# EAGLE schematic teensy-boom (EAGLE 7.3.0)

## Sheet 1 of 5
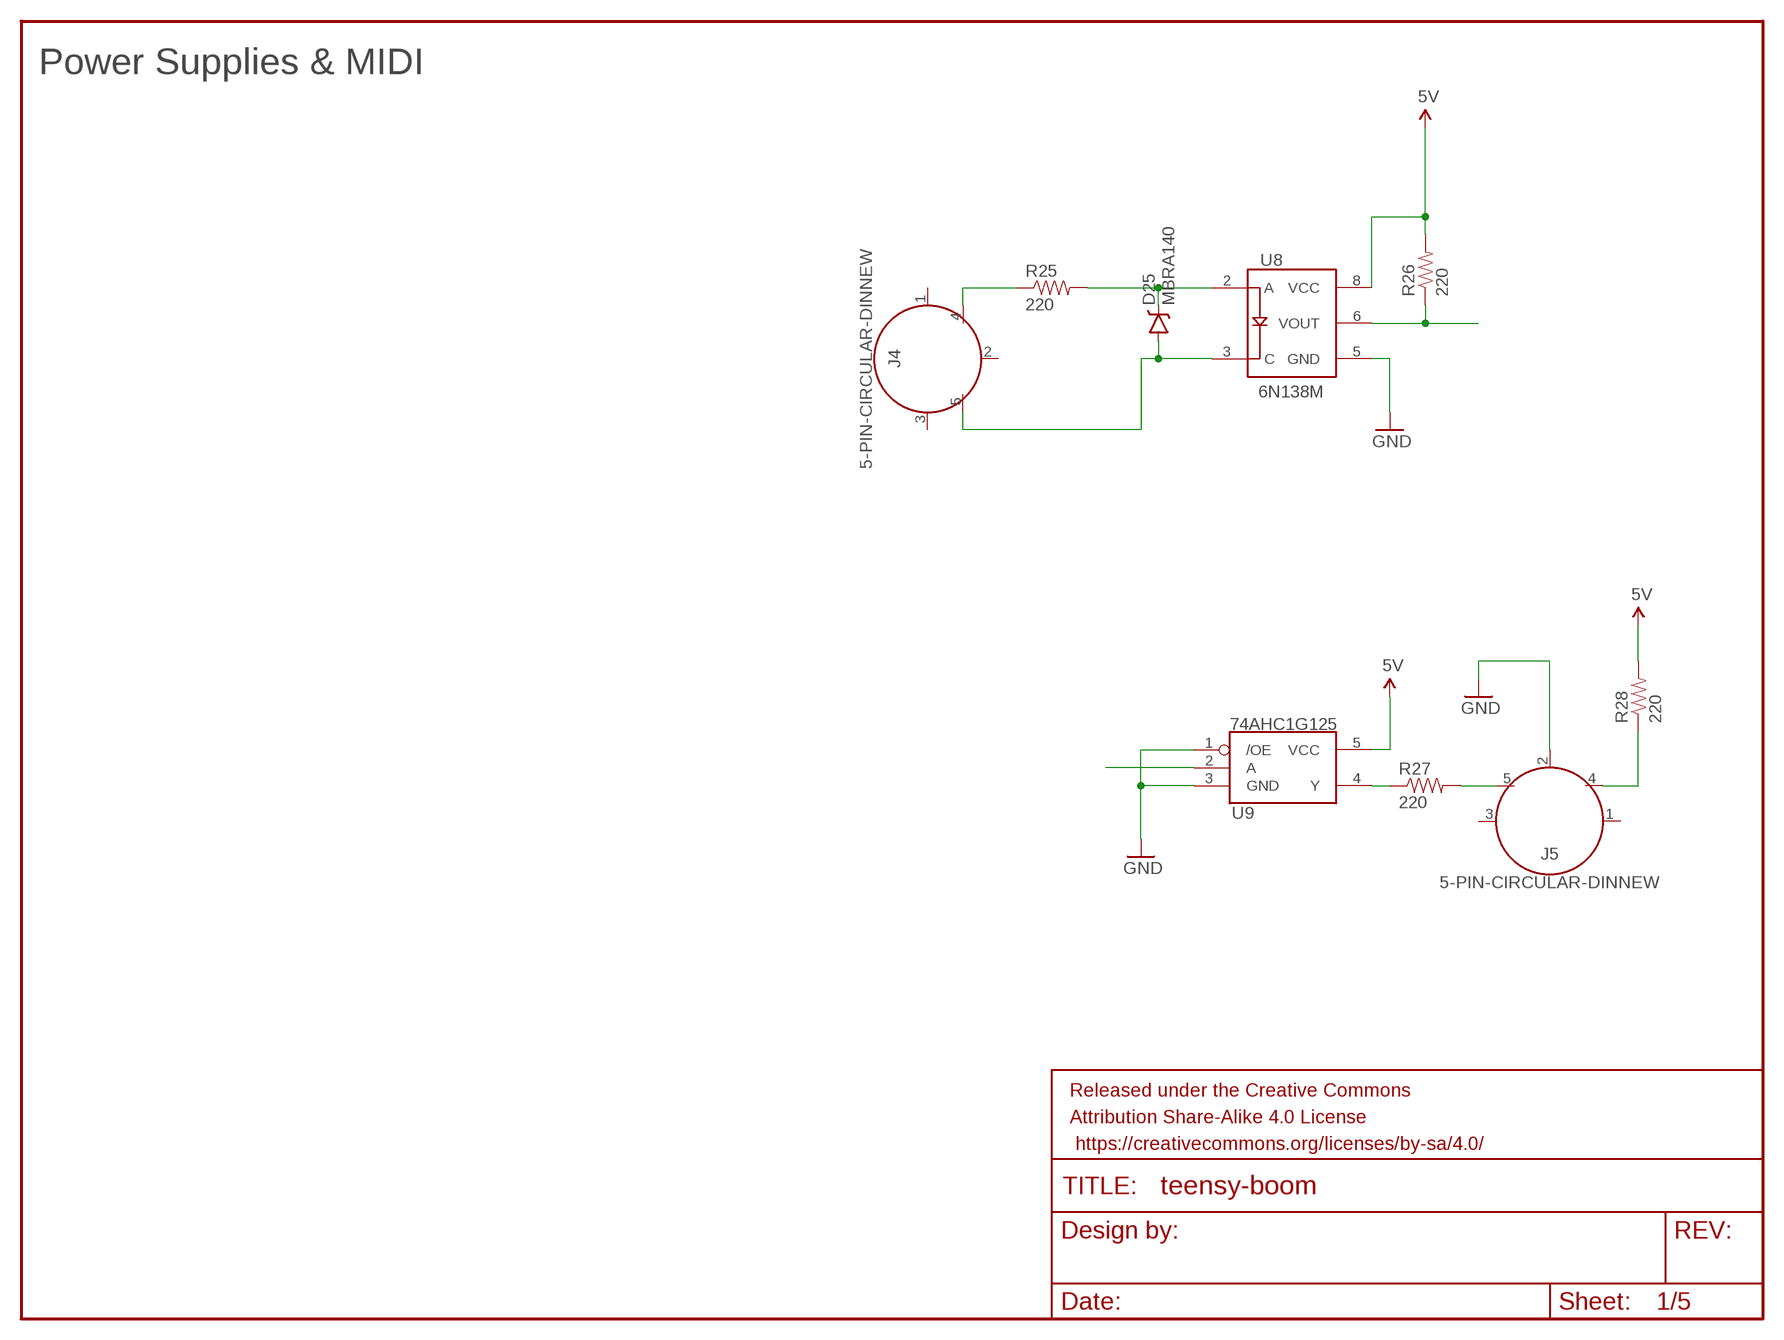
[diagram p0: schematic, sheet 1]

### Parts
D25  MBRA140  DIODE-SCHOTTKY-MBRA140  [SMA-DIODE]
FRAME2  FRAME-LETTERNO_PACKAGE  [DUMMY]
J4  5-PIN-CIRCULAR-DINNEW  [5-PIN-DIN-RA-PCB-NEW]
J5  5-PIN-CIRCULAR-DINNEW  [5-PIN-DIN-RA-PCB-NEW]
R25  220  220OHM-1/10W-1%(0603)  [0603-RES]
R26  220  220OHM-1/10W-1%(0603)  [0603-RES]
R27  220  220OHM-1/10W-1%(0603)  [0603-RES]
R28  220  220OHM-1/10W-1%(0603)  [0603-RES]
U8  6N138M  OPTO_DARL_6N138S  [8-SMD]
U9  74AHC1G125  [SOT23-5]

### Nets
5V: R26.2 R28.2 U8.8(VCC) U9.5(VCC)
GND: J5.2 U8.5(GND) U9.1(/OE) U9.3(GND) ; also sheet 2,3,4
N$1: U9.2(A)
N$2: J4.4 R25.1
N$3: D25.C R25.2 U8.2(A)
N$4: D25.A J4.5 U8.3(C)
N$5: R26.1 U8.6(VOUT)
N$7: R27.1 U9.4(Y)
N$8: J5.5 R27.2
N$9: J5.4 R28.1
Unconnected: J4.1 J4.2 J4.3 J5.1 J5.3

### Notes on the sheet
- Power Supplies & MIDI

## Sheet 2 of 5
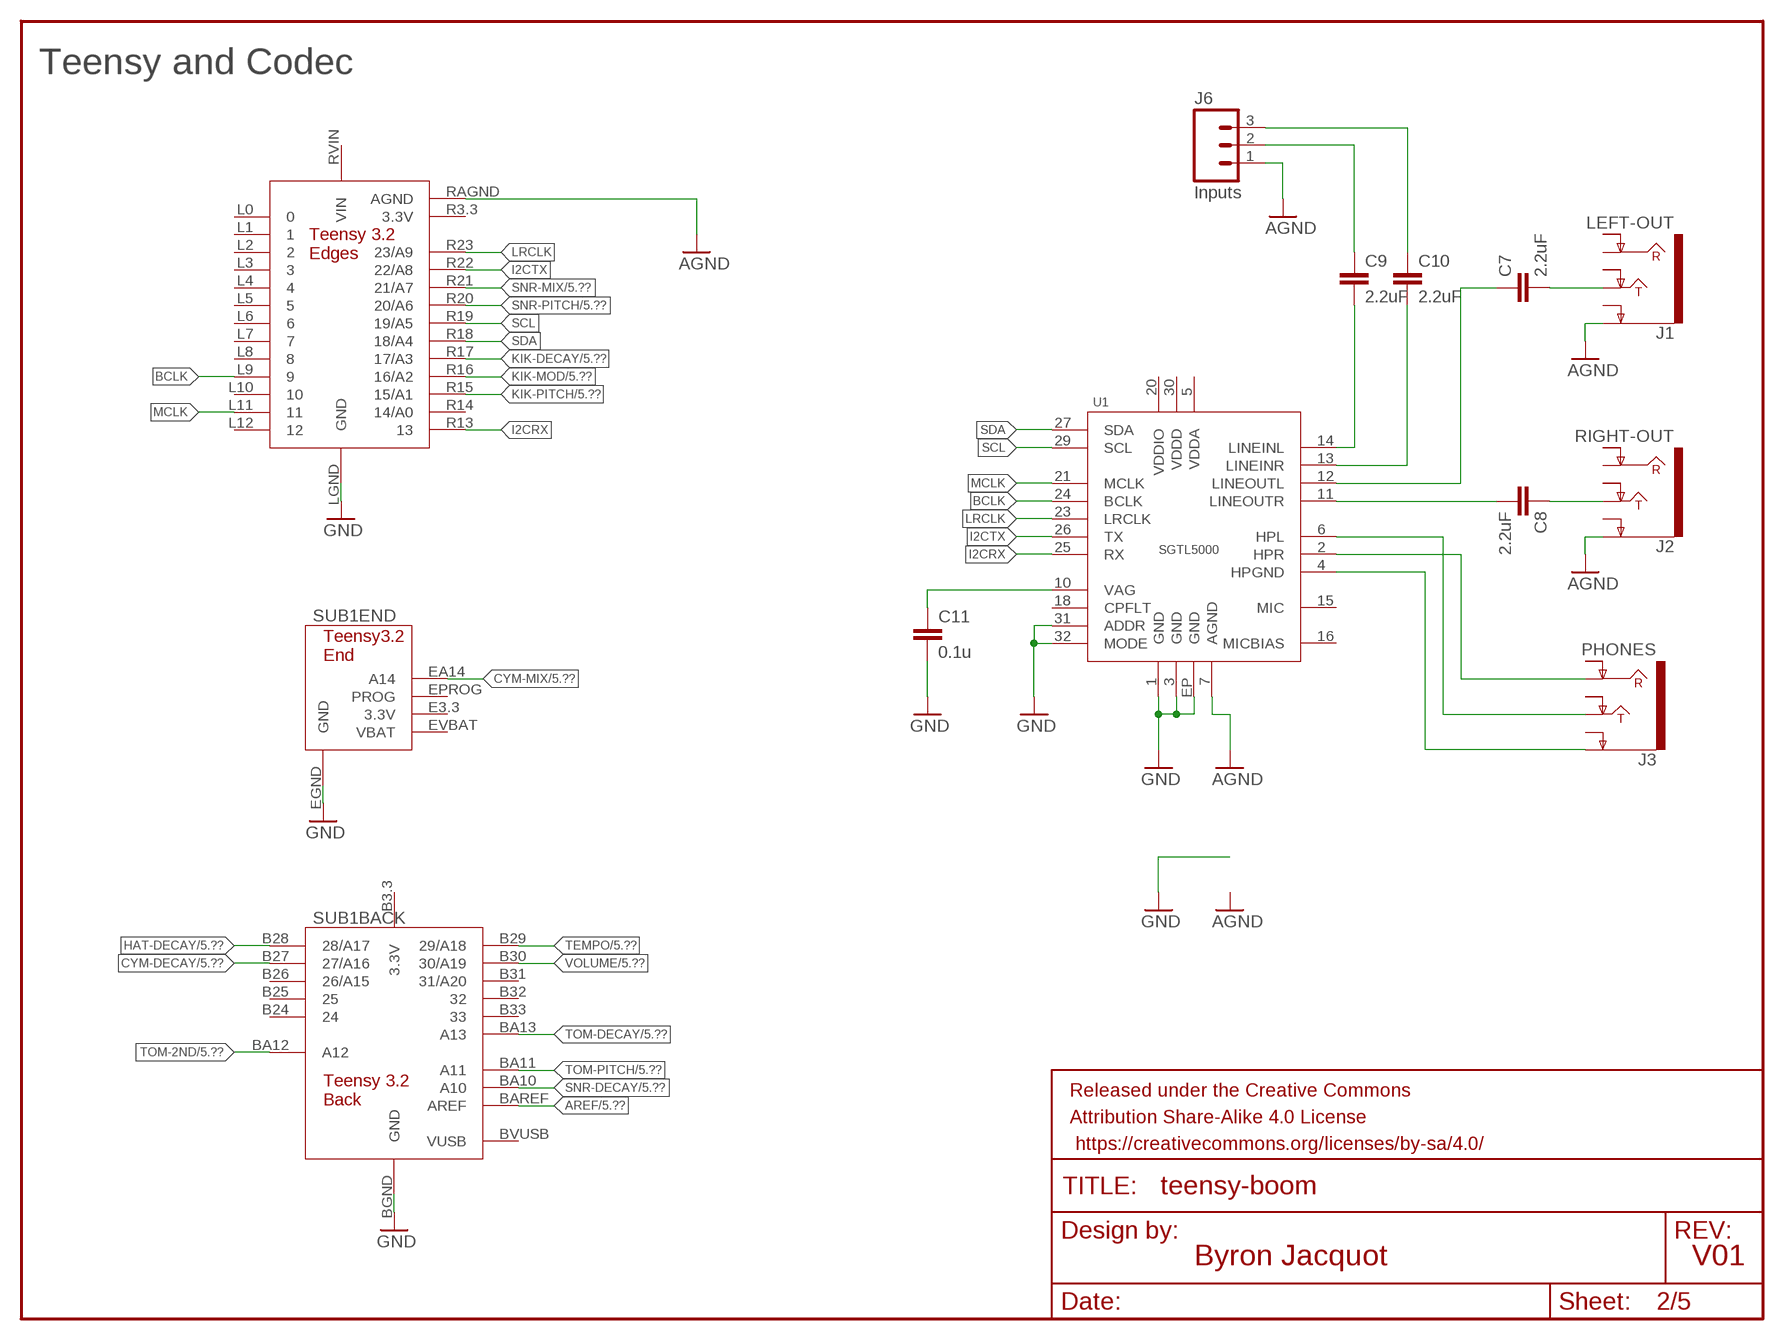
[diagram p1: schematic, sheet 2]

### Parts
C7  2.2uF  2.2UF-25V-+80/-20(0805)  [0805-CAP]
C8  2.2uF  2.2UF-25V-+80/-20(0805)  [0805-CAP]
C9  2.2uF  2.2UF-25V-+80/-20(0805)  [0805-CAP]
C10  2.2uF  2.2UF-25V-+80/-20(0805)  [0805-CAP]
C11  0.1u  CAP0805  [0805]
FRAME1  FRAME-LETTER  [CREATIVE_COMMONS]
J1  LEFT-OUT  AUDIO-JACK4-.25-HORIZ-TRS  [AUDIO-JACK-.25-INCH-HORIZ-PTH]
J2  RIGHT-OUT  AUDIO-JACK4-.25-HORIZ-TRS  [AUDIO-JACK-.25-INCH-HORIZ-PTH]
J3  PHONES  AUDIO-JACK4-.25-HORIZ-TRS  [AUDIO-JACK-.25-INCH-HORIZ-PTH]
J6  Inputs  M03LOCK  [1X03_LOCK]
SUB1  TEENSY-3.2PTH  [TEENSY-3.2]
U1  SGTL5000  SGTL5000QFN-32  [QFN-32]

### Nets
AGND: J1.SLEEVE(EARTH) J2.SLEEVE(EARTH) J6.1 SUB1.RAGND(EDGES:AGND) U1.7(AGND) ; also sheet 5
AREF: SUB1.BAREF(BACK:AREF) ; also sheet 5
BCLK: SUB1.L9 U1.24(BCLK)
CYM-DECAY: SUB1.B27(BACK:27/A16) ; also sheet 5
CYM-MIX: SUB1.EA14(END:A14) ; also sheet 5
GND: C11.2 SUB1.BGND(BACK:GND) SUB1.EGND(END:GND) SUB1.LGND(EDGES:GND) U1.1(GND) U1.3(GND) U1.31(ADDR) U1.32(MODE) U1.EP(GND) ; also sheet 1,3,4
HAT-DECAY: SUB1.B28(BACK:28/A17) ; also sheet 5
I2CRX: SUB1.R13 U1.25(RX)
I2CTX: SUB1.R22(EDGES:22/A8) U1.26(TX)
KIK-DECAY: SUB1.R17(EDGES:17/A3) ; also sheet 5
KIK-MOD: SUB1.R16(EDGES:16/A2) ; also sheet 5
KIK-PITCH: SUB1.R15(EDGES:15/A1) ; also sheet 5
LRCLK: SUB1.R23(EDGES:23/A9) U1.23(LRCLK)
MCLK: SUB1.L11 U1.21(MCLK)
N$25: C8.1 J2.TIP
N$58: C7.2 J1.TIP
N$59: C8.2 U1.11(LINEOUTR)
N$60: C7.1 U1.12(LINEOUTL)
N$61: C10.2 U1.13(LINEINR)
N$62: C9.2 U1.14(LINEINL)
N$63: J3.TIP U1.6(HPL)
N$64: J3.RING U1.2(HPR)
N$65: J3.SLEEVE(EARTH) U1.4(HPGND)
N$66: C9.1 J6.2
N$67: C10.1 J6.3
N$68: C11.1 U1.10(VAG)
SCL: SUB1.R19(EDGES:19/A5) U1.29(SCL)
SDA: SUB1.R18(EDGES:18/A4) U1.27(SDA)
SNR-DECAY: SUB1.BA10(BACK:A10) ; also sheet 5
SNR-MIX: SUB1.R21(EDGES:21/A7) ; also sheet 5
SNR-PITCH: SUB1.R20(EDGES:20/A6) ; also sheet 5
TEMPO: SUB1.B29(BACK:29/A18) ; also sheet 5
TOM-2ND: SUB1.BA12(BACK:A12) ; also sheet 5
TOM-DECAY: SUB1.BA13(BACK:A13) ; also sheet 5
TOM-PITCH: SUB1.BA11(BACK:A11) ; also sheet 5
VOLUME: SUB1.B30(BACK:30/A19) ; also sheet 5
Unconnected: J1.RING J1.RING-NORM J1.SLEEVE-NORM(EARTH-NORM) J1.TIP-NORM J2.RING J2.RING-NORM J2.SLEEVE-NORM(EARTH-NORM) J2.TIP-NORM J3.RING-NORM J3.SLEEVE-NORM(EARTH-NORM) J3.TIP-NORM SUB1.B3.3(BACK:3.3V) SUB1.B24 SUB1.B25 SUB1.B26(BACK:26/A15) SUB1.B31(BACK:31/A20) SUB1.B32 SUB1.B33 SUB1.BVUSB(BACK:VUSB) SUB1.E3.3(END:3.3V) SUB1.EPROG(END:PROG) SUB1.EVBAT(END:VBAT) SUB1.L0 SUB1.L1 SUB1.L2 SUB1.L3 SUB1.L4 SUB1.L5 SUB1.L6 SUB1.L7 SUB1.L8 SUB1.L10 SUB1.L12 SUB1.R3.3(EDGES:3.3V) SUB1.R14(EDGES:14/A0) SUB1.RVIN(EDGES:VIN) U1.5(VDDA) U1.15(MIC) U1.16(MICBIAS) U1.18(CPFLT) U1.20(VDDIO) U1.30(VDDD)

### Notes on the sheet
- Teensy and Codec
- Byron Jacquot | V01

## Sheet 3 of 5
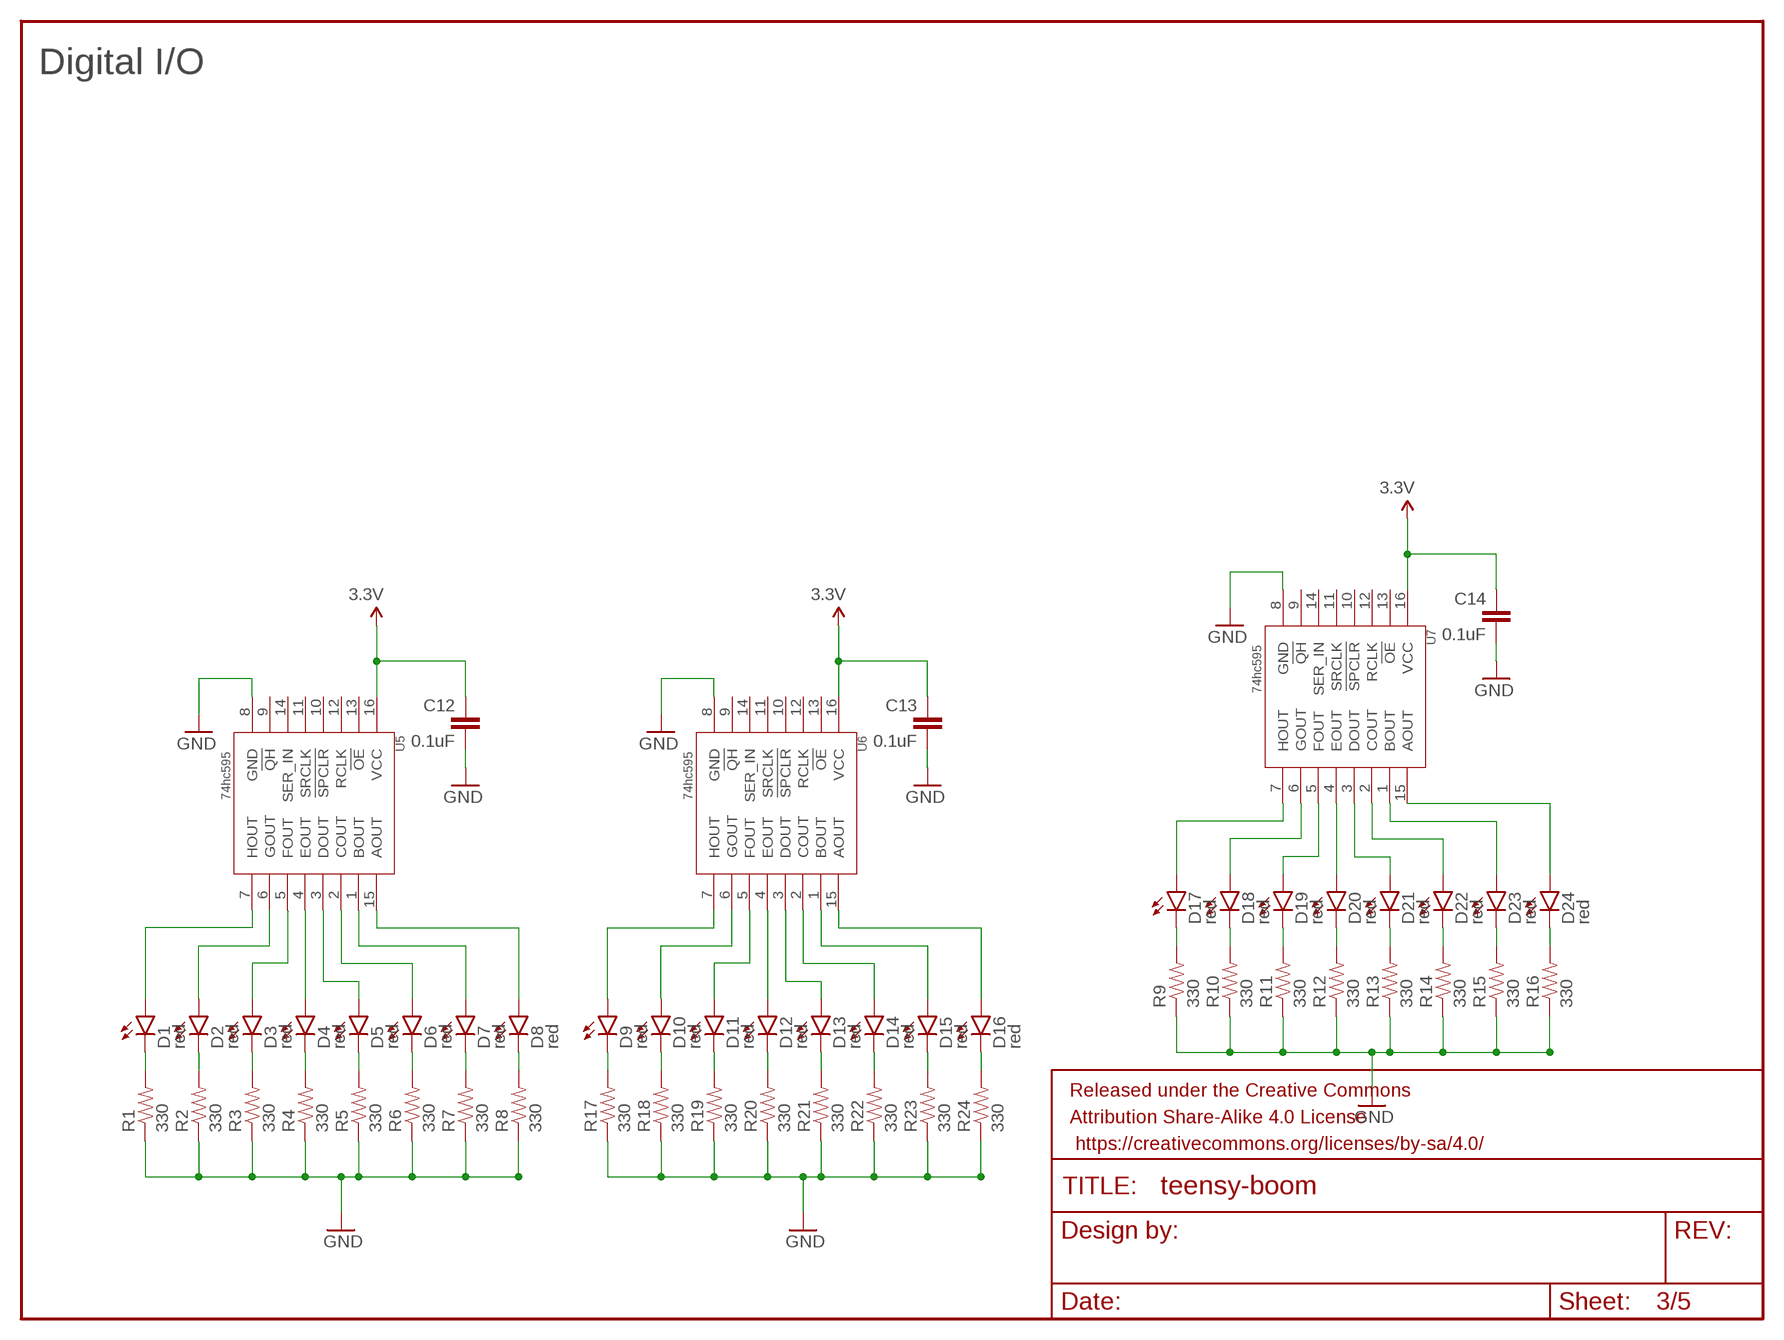
[diagram p2: schematic, sheet 3]

### Parts
C12  0.1uF  0.1UF-25V-5%(0603)  [0603-CAP]
C13  0.1uF  0.1UF-25V-5%(0603)  [0603-CAP]
C14  0.1uF  0.1UF-25V-5%(0603)  [0603-CAP]
D1  red  LED-3MM-NO_SILK  [LED3MM-NS]
D2  red  LED-3MM-NO_SILK  [LED3MM-NS]
D3  red  LED-3MM-NO_SILK  [LED3MM-NS]
D4  red  LED-3MM-NO_SILK  [LED3MM-NS]
D5  red  LED-3MM-NO_SILK  [LED3MM-NS]
D6  red  LED-3MM-NO_SILK  [LED3MM-NS]
D7  red  LED-3MM-NO_SILK  [LED3MM-NS]
D8  red  LED-3MM-NO_SILK  [LED3MM-NS]
D9  red  LED-3MM-NO_SILK  [LED3MM-NS]
D10  red  LED-3MM-NO_SILK  [LED3MM-NS]
D11  red  LED-3MM-NO_SILK  [LED3MM-NS]
D12  red  LED-3MM-NO_SILK  [LED3MM-NS]
D13  red  LED-3MM-NO_SILK  [LED3MM-NS]
D14  red  LED-3MM-NO_SILK  [LED3MM-NS]
D15  red  LED-3MM-NO_SILK  [LED3MM-NS]
D16  red  LED-3MM-NO_SILK  [LED3MM-NS]
D17  red  LED-3MM-NO_SILK  [LED3MM-NS]
D18  red  LED-3MM-NO_SILK  [LED3MM-NS]
D19  red  LED-3MM-NO_SILK  [LED3MM-NS]
D20  red  LED-3MM-NO_SILK  [LED3MM-NS]
D21  red  LED-3MM-NO_SILK  [LED3MM-NS]
D22  red  LED-3MM-NO_SILK  [LED3MM-NS]
D23  red  LED-3MM-NO_SILK  [LED3MM-NS]
D24  red  LED-3MM-NO_SILK  [LED3MM-NS]
FRAME3  FRAME-LETTERNO_PACKAGE  [DUMMY]
R1  330  330OHM1/10W1%(0603)  [0603-RES]
R2  330  330OHM1/10W1%(0603)  [0603-RES]
R3  330  330OHM1/10W1%(0603)  [0603-RES]
R4  330  330OHM1/10W1%(0603)  [0603-RES]
R5  330  330OHM1/10W1%(0603)  [0603-RES]
R6  330  330OHM1/10W1%(0603)  [0603-RES]
R7  330  330OHM1/10W1%(0603)  [0603-RES]
R8  330  330OHM1/10W1%(0603)  [0603-RES]
R9  330  330OHM1/10W1%(0603)  [0603-RES]
R10  330  330OHM1/10W1%(0603)  [0603-RES]
R11  330  330OHM1/10W1%(0603)  [0603-RES]
R12  330  330OHM1/10W1%(0603)  [0603-RES]
R13  330  330OHM1/10W1%(0603)  [0603-RES]
R14  330  330OHM1/10W1%(0603)  [0603-RES]
R15  330  330OHM1/10W1%(0603)  [0603-RES]
R16  330  330OHM1/10W1%(0603)  [0603-RES]
R17  330  330OHM1/10W1%(0603)  [0603-RES]
R18  330  330OHM1/10W1%(0603)  [0603-RES]
R19  330  330OHM1/10W1%(0603)  [0603-RES]
R20  330  330OHM1/10W1%(0603)  [0603-RES]
R21  330  330OHM1/10W1%(0603)  [0603-RES]
R22  330  330OHM1/10W1%(0603)  [0603-RES]
R23  330  330OHM1/10W1%(0603)  [0603-RES]
R24  330  330OHM1/10W1%(0603)  [0603-RES]
U5  74hc595  74HC595  [SO16]
U6  74hc595  74HC595  [SO16]
U7  74hc595  74HC595  [SO16]

### Nets
3.3V: C12.1 C13.1 C14.1 U5.16(VCC) U6.16(VCC) U7.16(VCC) ; also sheet 4
GND: C12.2 C13.2 C14.2 R1.1 R2.1 R3.1 R4.1 R5.1 R6.1 R7.1 R8.1 R9.1 R10.1 R11.1 R12.1 R13.1 R14.1 R15.1 R16.1 R17.1 R18.1 R19.1 R20.1 R21.1 R22.1 R23.1 R24.1 U5.8(GND) U6.8(GND) U7.8(GND) ; also sheet 1,2,4
N$6: D1.K(C) R1.2
N$10: D2.K(C) R2.2
N$11: D3.K(C) R3.2
N$12: D4.K(C) R4.2
N$13: D5.K(C) R5.2
N$14: D6.K(C) R6.2
N$15: D7.K(C) R7.2
N$16: D8.K(C) R8.2
N$17: D9.K(C) R17.2
N$18: D10.K(C) R18.2
N$19: D11.K(C) R19.2
N$20: D12.K(C) R20.2
N$21: D13.K(C) R21.2
N$22: D14.K(C) R22.2
N$23: D15.K(C) R23.2
N$24: D16.K(C) R24.2
N$26: D17.K(C) R9.2
N$27: D18.K(C) R10.2
N$28: D19.K(C) R11.2
N$29: D20.K(C) R12.2
N$30: D21.K(C) R13.2
N$31: D22.K(C) R14.2
N$32: D23.K(C) R15.2
N$33: D24.K(C) R16.2
N$34: D5.A U5.3(DOUT)
N$35: D4.A U5.4(EOUT)
N$36: D3.A U5.5(FOUT)
N$37: D2.A U5.6(GOUT)
N$38: D1.A U5.7(HOUT)
N$39: D6.A U5.2(COUT)
N$40: D7.A U5.1(BOUT)
N$41: D8.A U5.15(AOUT)
N$42: D12.A U6.4(EOUT)
N$43: D11.A U6.5(FOUT)
N$44: D10.A U6.6(GOUT)
N$45: D9.A U6.7(HOUT)
N$46: D13.A U6.3(DOUT)
N$47: D14.A U6.2(COUT)
N$48: D15.A U6.1(BOUT)
N$49: D16.A U6.15(AOUT)
N$50: D20.A U7.4(EOUT)
N$51: D19.A U7.5(FOUT)
N$52: D18.A U7.6(GOUT)
N$53: D17.A U7.7(HOUT)
N$54: D21.A U7.3(DOUT)
N$55: D24.A U7.15(AOUT)
N$56: D23.A U7.1(BOUT)
N$57: D22.A U7.2(COUT)
Unconnected: U5.9(!QH) U5.10(!SPCLR) U5.11(SRCLK) U5.12(RCLK) U5.13(!OE) U5.14(SER_IN) U6.9(!QH) U6.10(!SPCLR) U6.11(SRCLK) U6.12(RCLK) U6.13(!OE) U6.14(SER_IN) U7.9(!QH) U7.10(!SPCLR) U7.11(SRCLK) U7.12(RCLK) U7.13(!OE) U7.14(SER_IN)

### Notes on the sheet
- Digital I/O

## Sheet 4 of 5
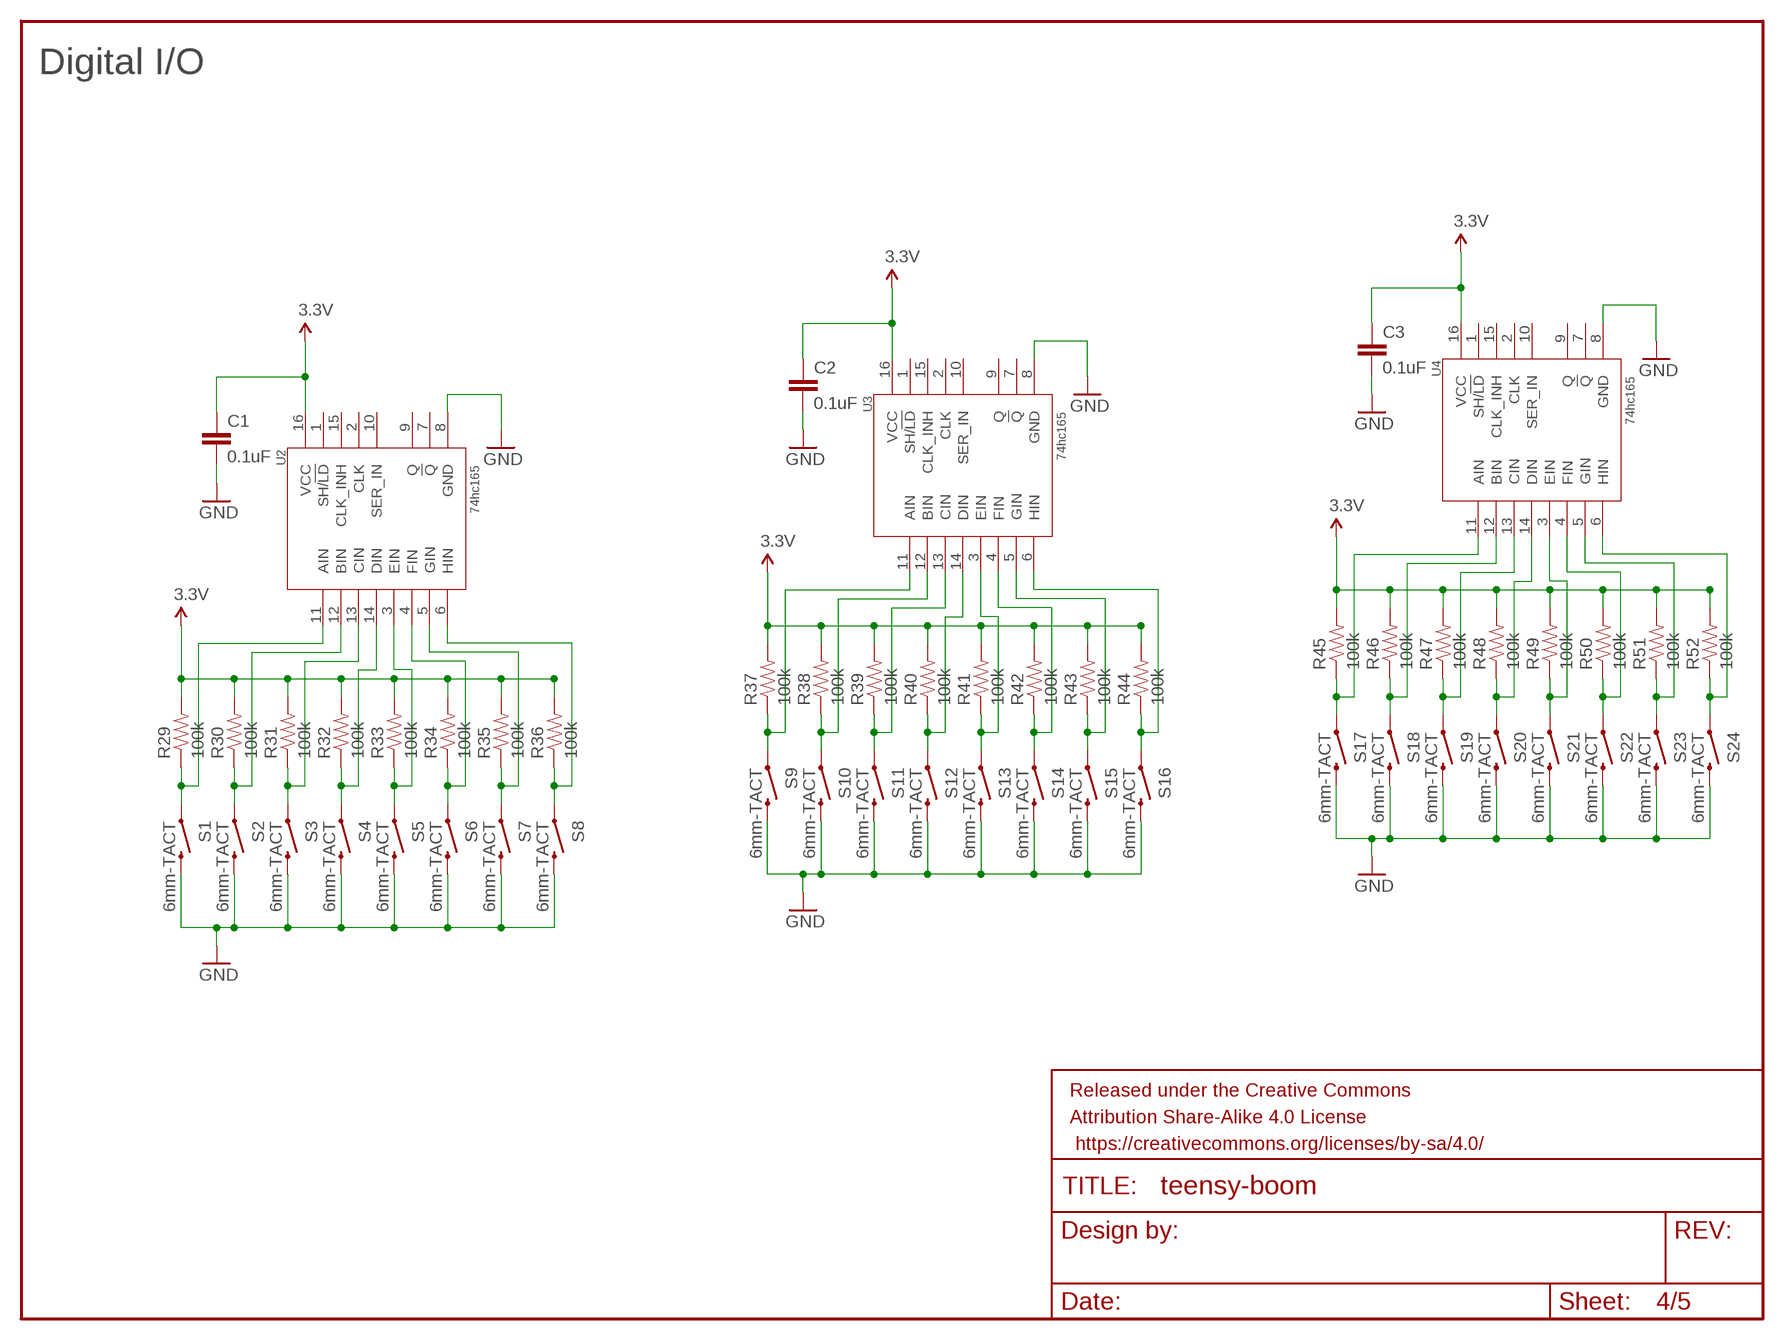
[diagram p3: schematic, sheet 4]

### Parts
C1  0.1uF  0.1UF-25V-5%(0603)  [0603-CAP]
C2  0.1uF  0.1UF-25V-5%(0603)  [0603-CAP]
C3  0.1uF  0.1UF-25V-5%(0603)  [0603-CAP]
FRAME5  FRAME-LETTERNO_PACKAGE  [DUMMY]
R29  100k  RESISTOR0805-RES  [0805]
R30  100k  RESISTOR0805-RES  [0805]
R31  100k  RESISTOR0805-RES  [0805]
R32  100k  RESISTOR0805-RES  [0805]
R33  100k  RESISTOR0805-RES  [0805]
R34  100k  RESISTOR0805-RES  [0805]
R35  100k  RESISTOR0805-RES  [0805]
R36  100k  RESISTOR0805-RES  [0805]
R37  100k  RESISTOR0805-RES  [0805]
R38  100k  RESISTOR0805-RES  [0805]
R39  100k  RESISTOR0805-RES  [0805]
R40  100k  RESISTOR0805-RES  [0805]
R41  100k  RESISTOR0805-RES  [0805]
R42  100k  RESISTOR0805-RES  [0805]
R43  100k  RESISTOR0805-RES  [0805]
R44  100k  RESISTOR0805-RES  [0805]
R45  100k  RESISTOR0805-RES  [0805]
R46  100k  RESISTOR0805-RES  [0805]
R47  100k  RESISTOR0805-RES  [0805]
R48  100k  RESISTOR0805-RES  [0805]
R49  100k  RESISTOR0805-RES  [0805]
R50  100k  RESISTOR0805-RES  [0805]
R51  100k  RESISTOR0805-RES  [0805]
R52  100k  RESISTOR0805-RES  [0805]
S1  6mm-TACT  SWITCH-MOMENTARY-2PTH  [TACTILE-PTH]
S2  6mm-TACT  SWITCH-MOMENTARY-2PTH  [TACTILE-PTH]
S3  6mm-TACT  SWITCH-MOMENTARY-2PTH  [TACTILE-PTH]
S4  6mm-TACT  SWITCH-MOMENTARY-2PTH  [TACTILE-PTH]
S5  6mm-TACT  SWITCH-MOMENTARY-2PTH  [TACTILE-PTH]
S6  6mm-TACT  SWITCH-MOMENTARY-2PTH  [TACTILE-PTH]
S7  6mm-TACT  SWITCH-MOMENTARY-2PTH  [TACTILE-PTH]
S8  6mm-TACT  SWITCH-MOMENTARY-2PTH  [TACTILE-PTH]
S9  6mm-TACT  SWITCH-MOMENTARY-2PTH  [TACTILE-PTH]
S10  6mm-TACT  SWITCH-MOMENTARY-2PTH  [TACTILE-PTH]
S11  6mm-TACT  SWITCH-MOMENTARY-2PTH  [TACTILE-PTH]
S12  6mm-TACT  SWITCH-MOMENTARY-2PTH  [TACTILE-PTH]
S13  6mm-TACT  SWITCH-MOMENTARY-2PTH  [TACTILE-PTH]
S14  6mm-TACT  SWITCH-MOMENTARY-2PTH  [TACTILE-PTH]
S15  6mm-TACT  SWITCH-MOMENTARY-2PTH  [TACTILE-PTH]
S16  6mm-TACT  SWITCH-MOMENTARY-2PTH  [TACTILE-PTH]
S17  6mm-TACT  SWITCH-MOMENTARY-2PTH  [TACTILE-PTH]
S18  6mm-TACT  SWITCH-MOMENTARY-2PTH  [TACTILE-PTH]
S19  6mm-TACT  SWITCH-MOMENTARY-2PTH  [TACTILE-PTH]
S20  6mm-TACT  SWITCH-MOMENTARY-2PTH  [TACTILE-PTH]
S21  6mm-TACT  SWITCH-MOMENTARY-2PTH  [TACTILE-PTH]
S22  6mm-TACT  SWITCH-MOMENTARY-2PTH  [TACTILE-PTH]
S23  6mm-TACT  SWITCH-MOMENTARY-2PTH  [TACTILE-PTH]
S24  6mm-TACT  SWITCH-MOMENTARY-2PTH  [TACTILE-PTH]
U2  74hc165  74HC165  [SO16]
U3  74hc165  74HC165  [SO16]
U4  74hc165  74HC165  [SO16]

### Nets
3.3V: C1.1 C2.1 C3.1 R29.2 R30.2 R31.2 R32.2 R33.2 R34.2 R35.2 R36.2 R37.2 R38.2 R39.2 R40.2 R41.2 R42.2 R43.2 R44.2 R45.2 R46.2 R47.2 R48.2 R49.2 R50.2 R51.2 R52.2 U2.16(VCC) U3.16(VCC) U4.16(VCC) ; also sheet 3
GND: C1.2 C2.2 C3.2 S1.3 S2.3 S3.3 S4.3 S5.3 S6.3 S7.3 S8.3 S9.3 S10.3 S11.3 S12.3 S13.3 S14.3 S15.3 S16.3 S17.3 S18.3 S19.3 S20.3 S21.3 S22.3 S23.3 S24.3 U2.8(GND) U3.8(GND) U4.8(GND) ; also sheet 1,2,3
N$69: R35.1 S7.1 U2.5(GIN)
N$70: R29.1 S1.1 U2.11(AIN)
N$71: R30.1 S2.1 U2.12(BIN)
N$72: R31.1 S3.1 U2.13(CIN)
N$73: R32.1 S4.1 U2.14(DIN)
N$74: R33.1 S5.1 U2.3(EIN)
N$75: R34.1 S6.1 U2.4(FIN)
N$76: R36.1 S8.1 U2.6(HIN)
N$77: R37.1 S9.1 U3.11(AIN)
N$78: R38.1 S10.1 U3.12(BIN)
N$79: R39.1 S11.1 U3.13(CIN)
N$80: R40.1 S12.1 U3.14(DIN)
N$81: R41.1 S13.1 U3.3(EIN)
N$82: R42.1 S14.1 U3.4(FIN)
N$83: R43.1 S15.1 U3.5(GIN)
N$84: R44.1 S16.1 U3.6(HIN)
N$85: R45.1 S17.1 U4.11(AIN)
N$86: R46.1 S18.1 U4.12(BIN)
N$87: R47.1 S19.1 U4.13(CIN)
N$88: R48.1 S20.1 U4.14(DIN)
N$89: R49.1 S21.1 U4.3(EIN)
N$90: R50.1 S22.1 U4.4(FIN)
N$91: R51.1 S23.1 U4.5(GIN)
N$840: R52.1 S24.1 U4.6(HIN)
Unconnected: U2.1(SH/!LD) U2.2(CLK) U2.7(!Q) U2.9(Q) U2.10(SER_IN) U2.15(CLK_INH) U3.1(SH/!LD) U3.2(CLK) U3.7(!Q) U3.9(Q) U3.10(SER_IN) U3.15(CLK_INH) U4.1(SH/!LD) U4.2(CLK) U4.7(!Q) U4.9(Q) U4.10(SER_IN) U4.15(CLK_INH)

### Notes on the sheet
- Digital I/O

## Sheet 5 of 5
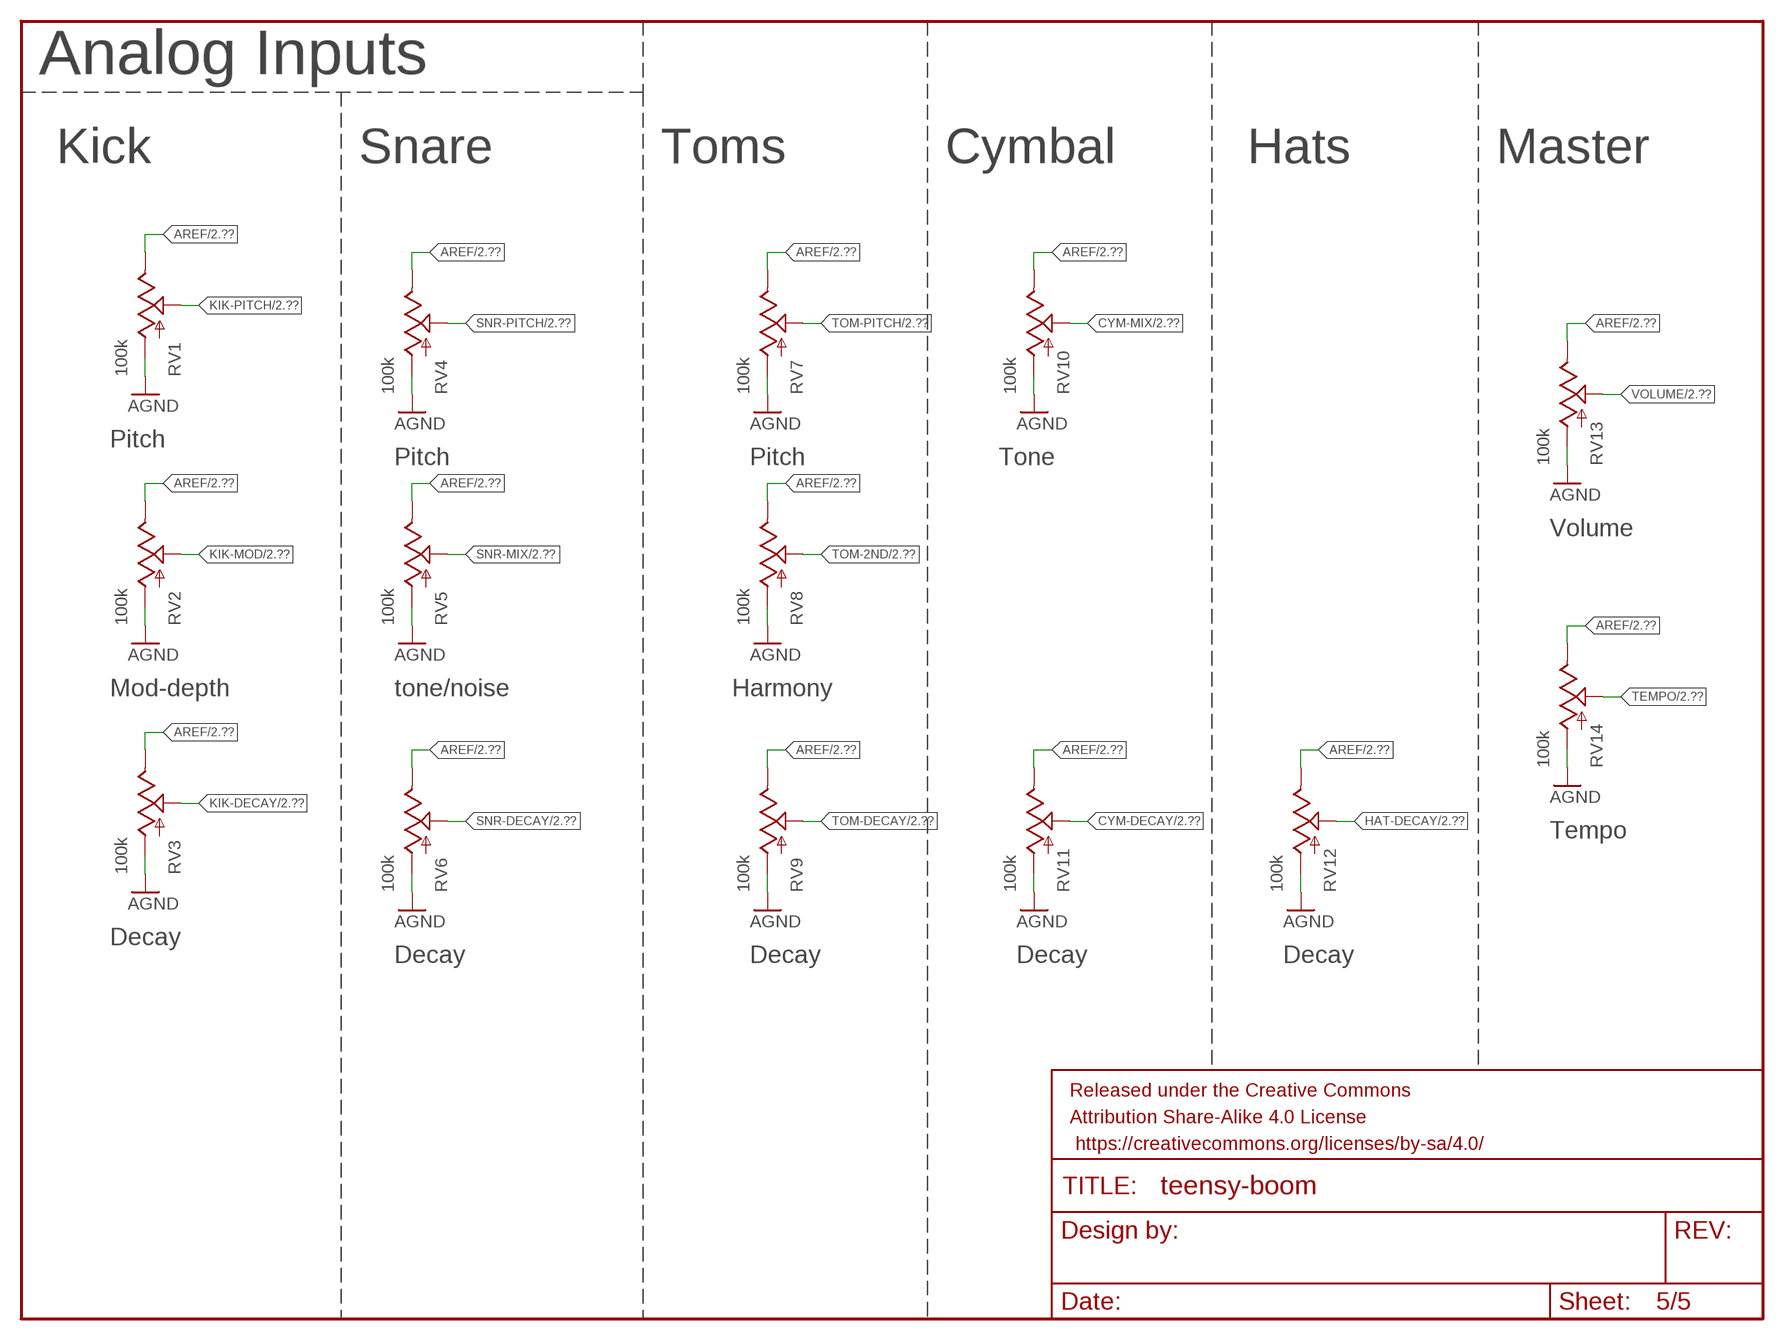
[diagram p4: schematic, sheet 5]

### Parts
FRAME4  FRAME-LETTERNO_PACKAGE  [DUMMY]
RV1  100k  POTALPS-KIT  [ALPS_POT_KIT]
RV2  100k  POTALPS-KIT  [ALPS_POT_KIT]
RV3  100k  POTALPS-KIT  [ALPS_POT_KIT]
RV4  100k  POTALPS-KIT  [ALPS_POT_KIT]
RV5  100k  POTALPS-KIT  [ALPS_POT_KIT]
RV6  100k  POTALPS-KIT  [ALPS_POT_KIT]
RV7  100k  POTALPS-KIT  [ALPS_POT_KIT]
RV8  100k  POTALPS-KIT  [ALPS_POT_KIT]
RV9  100k  POTALPS-KIT  [ALPS_POT_KIT]
RV10  100k  POTALPS-KIT  [ALPS_POT_KIT]
RV11  100k  POTALPS-KIT  [ALPS_POT_KIT]
RV12  100k  POTALPS-KIT  [ALPS_POT_KIT]
RV13  100k  POTALPS-KIT  [ALPS_POT_KIT]
RV14  100k  POTALPS-KIT  [ALPS_POT_KIT]

### Nets
AGND: RV1.P$3(A) RV2.P$3(A) RV3.P$3(A) RV4.P$3(A) RV5.P$3(A) RV6.P$3(A) RV7.P$3(A) RV8.P$3(A) RV9.P$3(A) RV10.P$3(A) RV11.P$3(A) RV12.P$3(A) RV13.P$3(A) RV14.P$3(A) ; also sheet 2
AREF: RV1.P$1(E) RV2.P$1(E) RV3.P$1(E) RV4.P$1(E) RV5.P$1(E) RV6.P$1(E) RV7.P$1(E) RV8.P$1(E) RV9.P$1(E) RV10.P$1(E) RV11.P$1(E) RV12.P$1(E) RV13.P$1(E) RV14.P$1(E) ; also sheet 2
CYM-DECAY: RV11.P$2(S) ; also sheet 2
CYM-MIX: RV10.P$2(S) ; also sheet 2
HAT-DECAY: RV12.P$2(S) ; also sheet 2
KIK-DECAY: RV3.P$2(S) ; also sheet 2
KIK-MOD: RV2.P$2(S) ; also sheet 2
KIK-PITCH: RV1.P$2(S) ; also sheet 2
SNR-DECAY: RV6.P$2(S) ; also sheet 2
SNR-MIX: RV5.P$2(S) ; also sheet 2
SNR-PITCH: RV4.P$2(S) ; also sheet 2
TEMPO: RV14.P$2(S) ; also sheet 2
TOM-2ND: RV8.P$2(S) ; also sheet 2
TOM-DECAY: RV9.P$2(S) ; also sheet 2
TOM-PITCH: RV7.P$2(S) ; also sheet 2
VOLUME: RV13.P$2(S) ; also sheet 2

### Notes on the sheet
- Analog Inputs
- Kick | Snare | Toms | Cymbal | Hats | Master
- Pitch
- Pitch | Pitch | Tone
- Volume
- Mod-depth | tone/noise | Harmony
- Tempo
- Decay
- Decay | Decay | Decay | Decay

## Library data of the parts
C1-C3 C12-C14 = SparkFun-Capacitors:0.1UF-25V-5%(0603): CAP-08604; PROD_ID: CAP-08604
C7-C10 = SparkFun-Capacitors:2.2UF-25V-+80/-20(0805): CAP-11624; PROD_ID: CAP-11624
C11 = SparkFun-Capacitors:CAP: Capacitor Standard 0603 ceramic capacitor, and 0.1" leaded capacitor.
D1-D24 = SparkFun-LED:LED: LEDs Standard schematic elements and footprints for 5mm, 3mm, 1206, and 0603 sized LEDs. 5mm - Spark Fun Electronics SKU : COM-00529 (and others)
D25 = SparkFun-DiscreteSemi:DIODE-SCHOTTKY: Schottky diodes in SFE's production catalog BAT20J 1A 23V 0.62Vf RB751 120mA 40V 0.37Vf PMEG4005EJ 0.5A 40V 0.42Vf MBRA140 1A 40V 0.5Vf B340A 3A 40V SMA; PROD_ID: DIO-08053
FRAME1 = SparkFun-Aesthetics:FRAME-LETTER: Schematic Frame Standard 8.5x11 US Letter frame
FRAME2-FRAME5 = SparkFun-Aesthetics:FRAME-LETTER: Schematic Frame Standard 8.5x11 US Letter frame; DESIGNER: Nobody; VERSION: v01
J1-J3 = SparkFun-Connectors:AUDIO-JACK4-.25-HORIZ-TRS: 1/4" TRS jack, horizontal Production SKU: COM-11144 Footprint unproven - datasheet and part seem to be slightly different; PROD_ID: CONN-12339; SF_ID: COM-11144
J4 J5 = Testing:5-PIN-CIRCULAR-DIN: 5-pin circular DIN connector. Fillsize variant is frequently used as a MIDI jack; PROD_ID: CONN-09481
J6 = SparkFun-Connectors:M03: Header 3 Standard 3-pin 0.1" header. Use with straight break away headers (SKU : PRT-00116), right angle break away headers (PRT-00553), swiss pins (PRT-00743), machine pins (PRT-00117), and female headers (PRT-00115). Molex polarized connector foot print use with SKU : PRT-08232 with associated crimp pins and housings.
R1-R24 = SparkFun-Resistors:330OHM1/10W1%(0603): RES-00818; PROD_ID: RES-00818
R25-R28 = SparkFun-Resistors:220OHM-1/10W-1%(0603): RES-07861; PROD_ID: RES-07861
R29-R52 = SparkFun-Resistors:RESISTOR: Resistor Basic schematic elements and footprints for 0603, 1206, and PTH resistors.
RV1-RV14 = SparkFun-Electromechanical:POT; PROD_ID: RES-09177
S1-S24 = SparkFun-Electromechanical:SWITCH-MOMENTARY-2: Various NO switches- pushbuttons, reed, etc; PROD_ID: SWCH-08441
SUB1 = teensy-synth:TEENSY-3.2
U1 = teensy-synth:SGTL5000
U2-U4 = teensy-synth:74HC165
U5-U7 = teensy-synth:74HC595
U8 = SparkFun-DiscreteSemi:OPTO_DARL_6N138S: Optoisolator, darlington pair output; PROD_ID: IC-09482
U9 = SparkFun-DigitalIC:74AHC1G125: Single bus buffer gate with 3-state output; PROD_ID: IC-11920